# Altium schematic sheet RFID.SchDoc
size A3; SheetNumber: 1; SheetTotal: 1
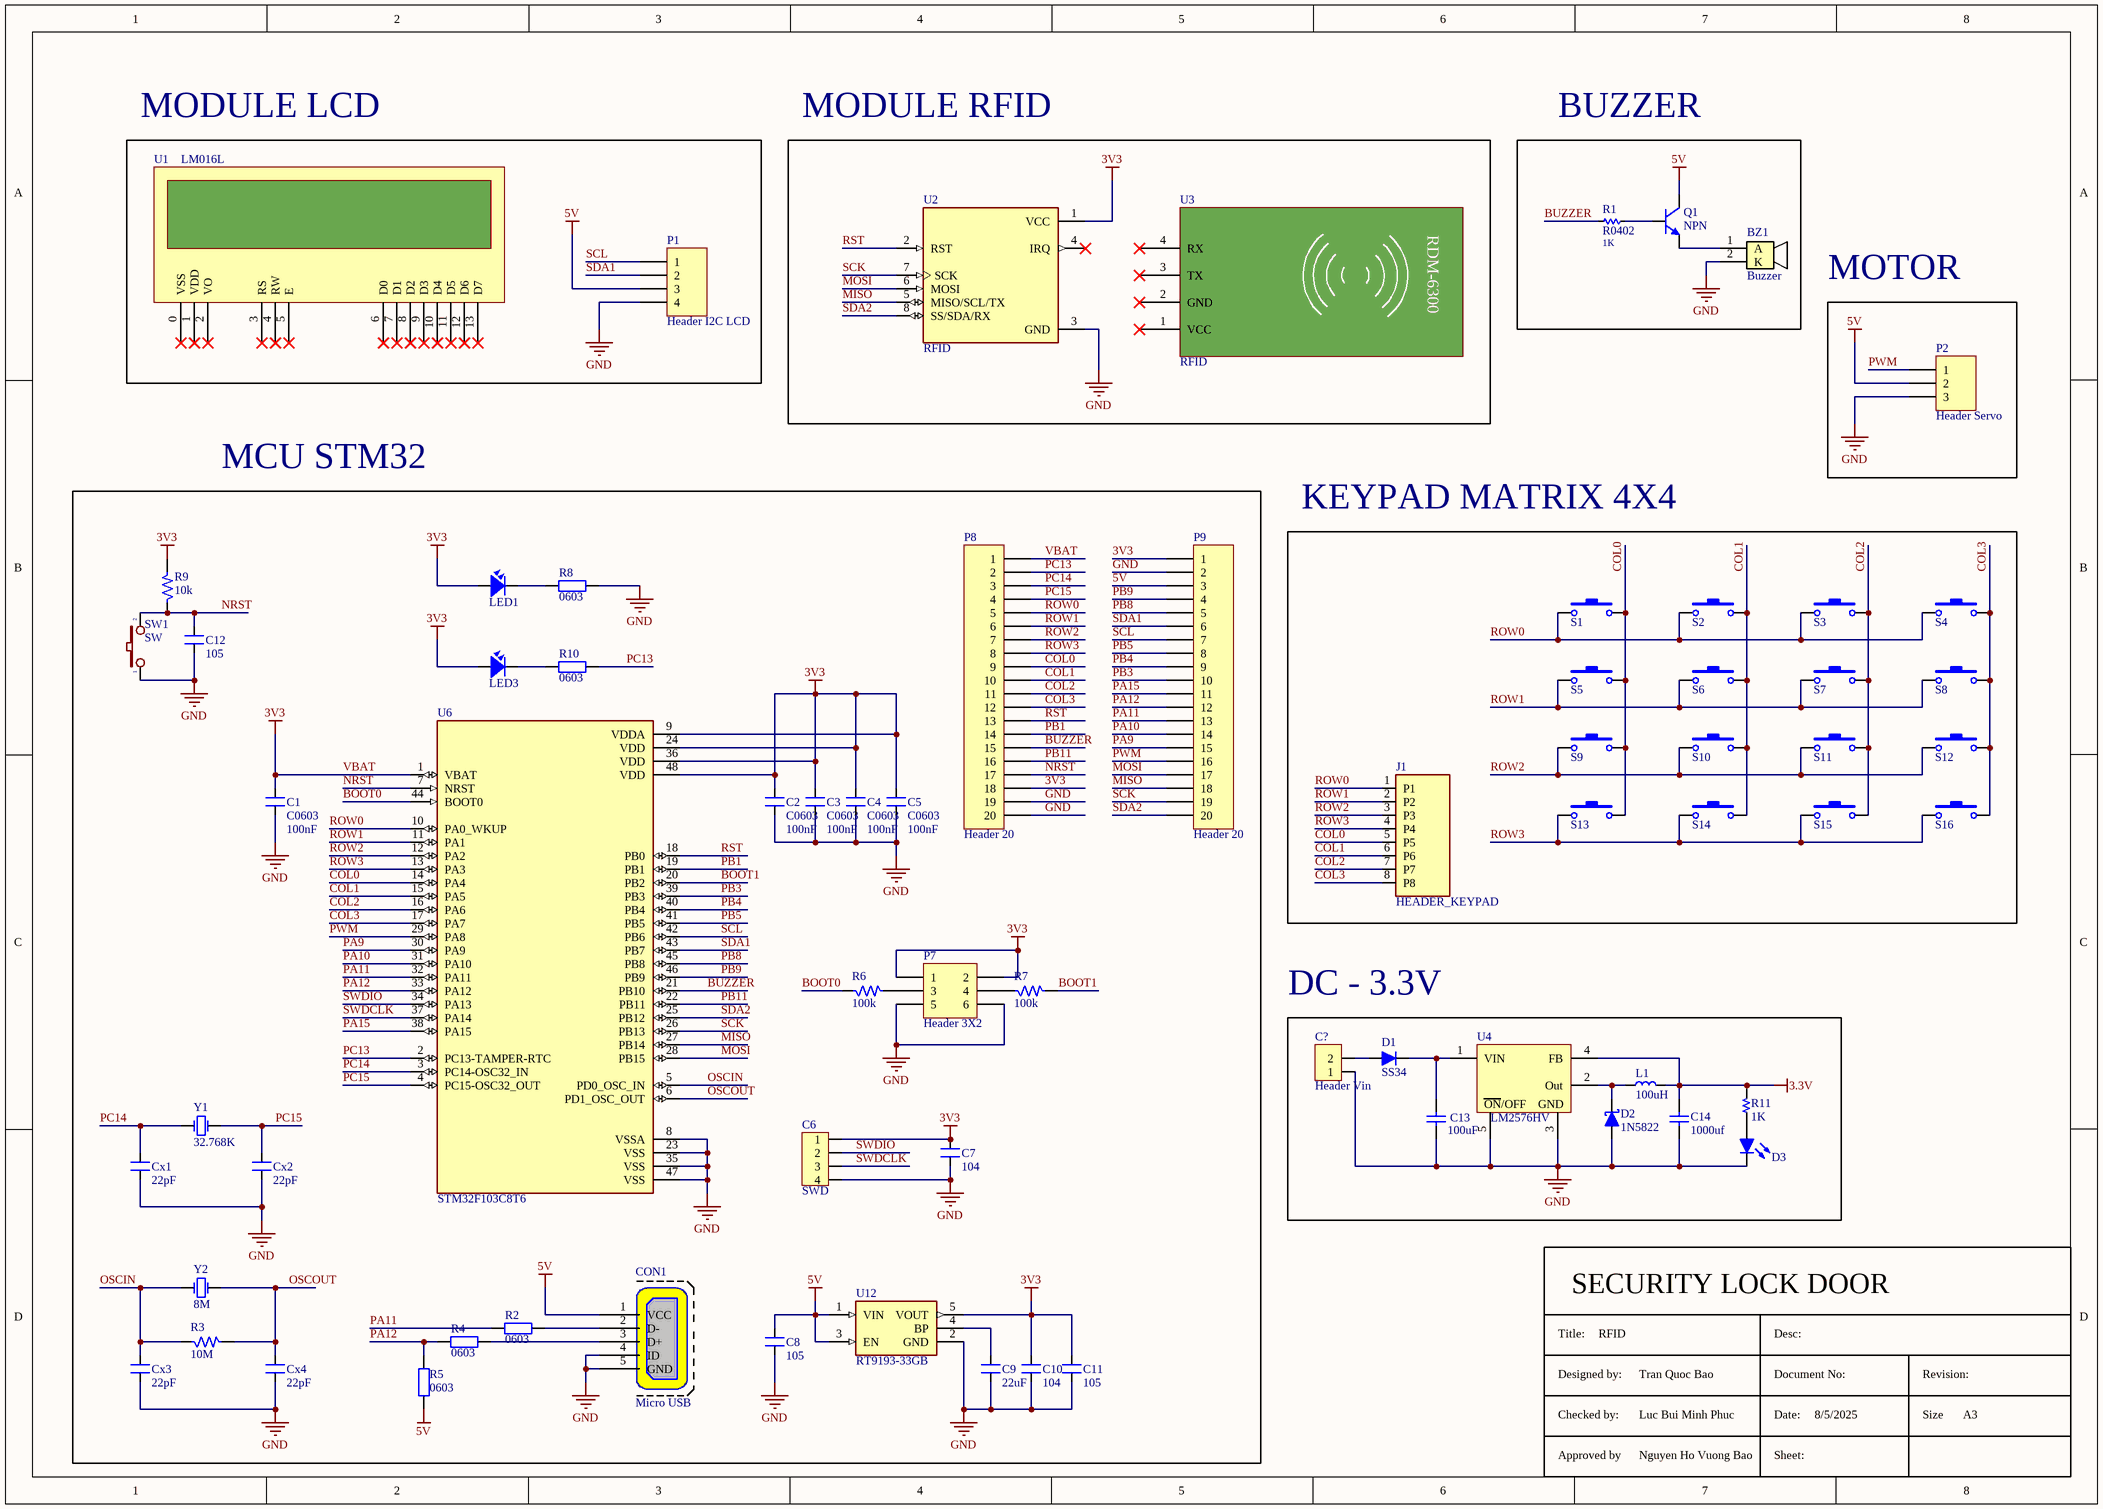
[diagram p0: RFID.SchDoc]

## Parts
BZ1  Buzzer  [BUZZER]
C1  C0603  value 100nF  [CN-SMD-0603]
C2  C0603  value 100nF  [CN-SMD-0603]
C3  C0603  value 100nF  [CN-SMD-0603]
C4  C0603  value 100nF  [CN-SMD-0603]
C5  C0603  value 100nF  [CN-SMD-0603]
C6  SWD  [HDR4]
C7  104  [CN2]
C8  105  [CN2]
C9  22uF  [CN2]
C10  104  [CN2]
C11  105  [CN2]
C12  105  [CN2]
C13  100uF  [C 0805]
C14  1000uf  [C 0805]
C?  Header Vin  [KF-128_2P]
CON1  Micro USB  [USB-B-Mini]
Cx1  22pF  [CN1]
Cx2  22pF  [CN1]
Cx3  22pF  [CN1]
Cx4  22pF  [CN1]
D1  SS34  [DO-35 (SOD27 )]
D2  1N5822  [DO-41]
D3  Led  [Led 0805 RED]  (value not drawn)
J1  HEADER_KEYPAD  [TE_826629-8]
L1  100uH  [Inductor SMD 12x12x8]
LED1  LED  [LED-3]  (value not drawn)
LED3  LED  [LED-3]  (value not drawn)
P1  Header I2C LCD  [HDR1X4]
P2  Header Servo  [HDR1X3]
P7  Header 3X2  [HDR2X3]
P8  Header 20  [HDR1X20]
P9  Header 20  [HDR1X20]
Q1  NPN  [TRAN-LOWPOWER]
R1  R0402  value 1K  [RES-SMD-0402]
R2  value 0603  [DIEN TRO 0805]  (hidden comment: R0603)
R3  10M  [SM-1206]
R4  value 0603  [DIEN TRO 0805]  (hidden comment: R0603)
R5  value 0603  [DIEN TRO 0805]  (hidden comment: R0603)
R6  100k  [SM-1206]
R7  100k  [SM-1206]
R8  value 0603  [DIEN TRO 0805]  (hidden comment: R0603)
R9  10k  [SM-1206]
R10  value 0603  [DIEN TRO 0805]  (hidden comment: R0603)
R11  1K  [R 0805]
S1  SW-SMD  [SW-SMD]  (value not drawn)
S2  SW-SMD  [SW-SMD]  (value not drawn)
S3  SW-SMD  [SW-SMD]  (value not drawn)
S4  SW-SMD  [SW-SMD]  (value not drawn)
S5  SW-SMD  [SW-SMD]  (value not drawn)
S6  SW-SMD  [SW-SMD]  (value not drawn)
S7  SW-SMD  [SW-SMD]  (value not drawn)
S8  SW-SMD  [SW-SMD]  (value not drawn)
S9  SW-SMD  [SW-SMD]  (value not drawn)
S10  SW-SMD  [SW-SMD]  (value not drawn)
S11  SW-SMD  [SW-SMD]  (value not drawn)
S12  SW-SMD  [SW-SMD]  (value not drawn)
S13  SW-SMD  [SW-SMD]  (value not drawn)
S14  SW-SMD  [SW-SMD]  (value not drawn)
S15  SW-SMD  [SW-SMD]  (value not drawn)
S16  SW-SMD  [SW-SMD]  (value not drawn)
SW1  SW  [SW2]
U1  LM016L
U2  RFID  [MODULE_CEG006900]
U3  RFID
U4  LM2576HV  [TO-263-5]
U6  STM32F103C8T6  [QFP50P900X900X160-48N]
U12  RT9193-33GB  [SOT94P279X129-5N]
Y1  32.768K  [xtal]
Y2  8M  [xtal]

## Blocks framed on the sheet
MODULE LCD: P1 U1
MODULE RFID: U2 U3
BUZZER: BZ1 Q1 R1
MOTOR: P2
MCU STM32: C1-C12 CON1 Cx1-Cx4 LED1 LED3 P7-P9 R2-R10 SW1 U6 U12 Y1 Y2
KEYPAD MATRIX 4X4: J1 S1-S16
DC - 3.3V: C13 C14 C? D1-D3 L1 R11 U4

## Nets
3.3V: C14.1 L1.2 R11.2 U4.4(FB)
3V3: C1.2 C2.2 C3.2 C4.2 C5.2 C6.1 C7.2 C10.2 C11.2 LED1.1 LED3.1 P7.1 P7.2 P8.1 P8.18 P9.1 R9.2 U2.1(VCC) U6.1(VBAT) U6.9(VDDA) U6.24(VDD) U6.36(VDD) U6.48(VDD) U12.5(VOUT)  [also labelled VBAT]
5V: C8.2 CON1.1(VCC) P1.3 P2.2 P9.3 Q1.2(C) R5.1 U12.1(VIN) U12.3(EN)
GND: BZ1.2(K) C1.1 C2.1 C3.1 C4.1 C5.1 C6.4 C7.1 C8.1 C9.1 C10.1 C11.1 C12.1 C13.2 C14.2 C?.1 CON1.4(ID) CON1.5(GND) CON1.6(GND) CON1.7(GND) CON1.8(GND) CON1.9(GND) Cx1.1 Cx2.1 Cx3.1 Cx4.1 D2.1(A) D3.2(K) P1.4 P2.3 P7.5 P7.6 P8.19 P8.20 P9.2 R8.2 SW1.1 U2.3(GND) U4.3(GND) U4.5(~{ON}/OFF) U6.8(VSSA) U6.23(VSS) U6.35(VSS) U6.47(VSS) U12.2(GND)
BOOT0: R6.1 U6.44(BOOT0)
BOOT1: R7.2 U6.20(PB2)
BUZZER: P8.15 R1.2 U6.21(PB10)
COL0: J1.5(P5) P8.9 S1.2 S5.2 S9.2 S13.2 U6.14(PA4)
COL1: J1.6(P6) P8.10 S2.2 S6.2 S10.2 S14.2 U6.15(PA5)
COL2: J1.7(P7) P8.11 S3.2 S7.2 S11.2 S15.2 U6.16(PA6)
COL3: J1.8(P8) P8.12 S4.2 S8.2 S12.2 S16.2 U6.17(PA7)
MISO: P9.18 U2.5(MISO/SCL/TX) U6.27(PB14)
MOSI: P9.17 U2.6(MOSI) U6.28(PB15)
NRST: C12.2 P8.17 R9.1 SW1.2 U6.7(NRST)
OSCIN: Cx3.2 R3.1 U6.5(PD0_OSC_IN) Y2.1(OSC1)
OSCOUT: Cx4.2 R3.2 U6.6(PD1_OSC_OUT) Y2.2(OSC2)
PA9: P9.15 U6.30(PA9)
PA10: P9.14 U6.31(PA10)
PA11: P9.13 R2.1 U6.32(PA11)
PA12: P9.12 R4.1 R5.2 U6.33(PA12)
PA15: P9.11 U6.38(PA15)
PB1: P8.14 U6.19(PB1)
PB3: P9.10 U6.39(PB3)
PB4: P9.9 U6.40(PB4)
PB5: P9.8 U6.41(PB5)
PB8: P9.5 U6.45(PB8)
PB9: P9.4 U6.46(PB9)
PB11: P8.16 U6.22(PB11)
PC13: P8.2 R10.2 U6.2(PC13-TAMPER-RTC)
PC14: Cx1.2 P8.3 U6.3(PC14-OSC32_IN) Y1.1(OSC1)
PC15: Cx2.2 P8.4 U6.4(PC15-OSC32_OUT) Y1.2(OSC2)
PWM: P2.1 P9.16 U6.29(PA8)
ROW0: J1.1(P1) P8.5 S1.1 S2.1 S3.1 S4.1 U6.10(PA0_WKUP)
ROW1: J1.2(P2) P8.6 S5.1 S6.1 S7.1 S8.1 U6.11(PA1)
ROW2: J1.3(P3) P8.7 S9.1 S10.1 S11.1 S12.1 U6.12(PA2)
ROW3: J1.4(P4) P8.8 S13.1 S14.1 S15.1 S16.1 U6.13(PA3)
RST: P8.13 U2.2(RST) U6.18(PB0)
SCK: P9.19 U2.7(SCK) U6.26(PB13)
SCL: P1.1 P9.7 U6.42(PB6)
SDA1: P1.2 P9.6 U6.43(PB7)
SDA2: P9.20 U2.8(SS/SDA/RX) U6.25(PB12)
SWDCLK: C6.3 U6.37(PA14)
SWDIO: C6.2 U6.34(PA13)
NetBZ1_1: BZ1.1(A) Q1.1(E)
NetC9_2: C9.2 U12.4(BP)
NetC13_1: C13.1 D1.2(K) U4.1(VIN)
NetC?_2: C?.2 D1.1(A)
NetCON1_2: CON1.2(D-) R2.2
NetCON1_3: CON1.3(D+) R4.2
NetD2_2: D2.2(K) L1.1 U4.2(Out)
NetD3_1: D3.1(A) R11.1
NetLED1_2: LED1.2 R8.1
NetLED3_2: LED3.2 R10.1
NetP7_3: P7.3 R6.2
NetP7_4: P7.4 R7.1
NetQ1_3: Q1.3(B) R1.1

Not connected (* = marked no-connect by the designer): U1 0(VSS)* 1(VDD)* 2(VO)* 3(RS)* 4(RW)* 5(E)* 6(D0)* 7(D1)* 8(D2)* 9(D3)* 10(D4)* 11(D5)* 12(D6)* 13(D7)*; U2 4(IRQ)*; U3 1(VCC)* 2(GND)* 3(TX)* 4(RX)*; U4 6(PAD)

## Notes on the sheet
- SECURITY LOCK DOOR
- Title:
- Designed by:
- RFID
- Tran Quoc Bao
- Desc:
- Document No:
- Revision:
- Checked by:
- Approved by
- Luc Bui Minh Phuc
- Nguyen Ho Vuong Bao
- Date:
- Sheet:
- 8/5/2025
- Size
- A3
- (in symbol LM2596S-5.0) ON/OFF
- (in symbol RFID) RDM-6300

## Library data of the parts
C1-C5 = CAP-SMD-0603: Cap SMD
C6 = Header4: Header IDC, 4 x 1 Pin Vertical 2.54mm Pitch (Non-Boxed, Male); Manufacturer: W¨¹rth Elektronik eiSos GmbH; partNo: 613002143121; ComponentLink1 Description: Manufacturer; ComponentLink2 Description: Datasheet; NoPins: 02; Created Date: 29 March 2013; ComponentLink1URL: http://www.we-online.com; ComponentLink2URL: http://katalog.we-online.de/em/datasheet/6130xx143121.pdf; Created by: Karrer Zheng
C7-C12 = CN2: Cap np 104 => 105pF; Value: 0.1uF
C13 C14 = Capacitor NP: Capacitor non-pol
C? = Header2: Header IDC, 2 x 1 Pin Vertical 2.54mm Pitch (Non-Boxed, Male); Manufacturer: W¨¹rth Elektronik eiSos GmbH; partNo: 613002143121; ComponentLink1 Description: Manufacturer; ComponentLink2 Description: Datasheet; NoPins: 02; Created Date: 29 March 2013; ComponentLink1URL: http://www.we-online.com; ComponentLink2URL: http://katalog.we-online.de/em/datasheet/6130xx143121.pdf; Created by: Karrer Zheng
CON1 = USB Mini B: Value: USB Mini B
Cx1-Cx4 = CAP-DIP: Cremic For Xtal 1pF => 100pF; Value: 33pF
D1 = Diode: Default Diode
D2 = Diode Schottky: Schottky Diode
D3 = Led: Typical LED
J1 = 826629-8: Conn Unshrouded Header HDR 8 POS 2.54mm Solder ST Thru-Hole Automotive Box; MF: TE Connectivity; Value: *; SnapEDA_Link: https://www.snapeda.com/parts/826629-8/TE+Connectivity+AMP+Connectors/view-part/?ref=snap; Purchase-URL: https://pricing.snapeda.com/search/part/826629-8/?ref=eda; EU_RoHS_Compliance: Compliant; Availability: In Stock; Price: None; Package: None; Check_prices: https://www.snapeda.com/parts/826629-8/TE+Connectivity+AMP+Connectors/view-part/?ref=eda; MP: 826629-8
L1 = Inductor
LED1 LED3 = LED: LED Single colour Green and Red; Value: LED 3 ly Single Colour
P1 = Header 4: Header, 4-Pin; LatestRevisionDate: 17-Jul-2002; LatestRevisionNote: Re-released for DXP Platform.; Publisher: Altium Limited
P2 = Header 3: Header, 3-Pin; LatestRevisionDate: 17-Jul-2002; LatestRevisionNote: Re-released for DXP Platform.; Publisher: Altium Limited
P7 = Header 3X2: Header, 3-Pin, Dual row; LatestRevisionDate: 17-Jul-2002; LatestRevisionNote: Re-released for DXP Platform.; Publisher: Altium Limited
P8 P9 = Header 20: Header, 20-Pin; LatestRevisionDate: 17-Jul-2002; LatestRevisionNote: Re-released for DXP Platform.; Publisher: Altium Limited
Q1 = NPN: NPN General; Published: 8-Jun-2000; LatestRevisionDate: 15-Jan-2003; LatestRevisionNote: PCB Footprint 'BCY-W3/D4.7' replaced; DatasheetDocument: 1997; PackageDocument: Sep-1998; PackageReference: TO-92A; Publisher: Altium Limited; Code_JEDEC: TO-92A; ComponentLink1Description: Manufacturer Link; ComponentLink1URL: http://www.fairchildsemi.com/; ComponentLink2Description: Datasheet; ComponentLink2URL: http://www.fairchildsemi.com/ds/2N%2F2N3904.pdf
R1 = Res-SMD-0402: Resistor; Manufacturer: Generic Components; Class: Passive; Published: 08/06/2000; Publisher: Altium Hobart Technology Centre
R2 R4 R5 R8 R10 = R0603: Resistor SMD 0603; Published: 8-Jun-2000; LatestRevisionDate: 17-Jul-2002; LatestRevisionNote: Re-released for DXP Platform.; PackageReference: AXIAL-0.4; Publisher: Altium Limited
R3 R6 R7 R9 = R: Resistor 1/4W; Value: R1/4W - 1K
R11 = Resistor
S1-S16 = SW-SMD: Switch; Published: 24-Mar-1999; LatestRevisionDate: 17-Jul-2002; LatestRevisionNote: Re-released for DXP Platform.; PackageReference: SPST-2; Publisher: Altium Limited
SW1 = SW2: Switch button 2 pin; Value: SW chip 2 pin
U2 = CEG006900: RFID RC522 Reader IC Card Module Tags SPI Interface Read and Write; MF: YKS; Value: *; SnapEDA_Link: https://www.snapeda.com/parts/CEG006900/YKS/view-part/?ref=snap; MP: CEG006900; Check_prices: https://www.snapeda.com/parts/CEG006900/YKS/view-part/?ref=eda; Availability: Not in stock; Price: None; Package: None
U4 = LM2596S-5.0: Simple Switcher 3A Step-Down Voltage Regulator
U6 = STM32F103C8T6: ARM® Cortex®-M3 STM32F1 Microcontroller IC 32-Bit 72MHz 64KB (64K x 8) FLASH 48-LQFP (7x7); MF: STMicroelectronics; SnapEDA_Link: https://www.snapeda.com/parts/STM32F103C8T6/STMicroelectronics/view-part/?ref=snap; Package: LQFP-48 STMicroelectronics; Value: *; MP: STM32F103C8T6; Check_prices: https://www.snapeda.com/parts/STM32F103C8T6/STMicroelectronics/view-part/?ref=eda
U12 = RT9193-33GB: Linear Voltage Regulator IC Positive Fixed 1 Output 300mA TSOT-23-5; MF: Richtek USA; SnapEDA_Link: https://www.snapeda.com/parts/RT9193-33GB/Richtek+USA+Inc./view-part/?ref=snap; Package: SOT-23-5 Richtek; MP: RT9193-33GB; Check_prices: https://www.snapeda.com/parts/RT9193-33GB/Richtek+USA+Inc./view-part/?ref=eda; Purchase-URL: https://pricing.snapeda.com/search/part/RT9193-33GB/?ref=eda; Digi-Key_Part_Number: 1028-1014-2-ND; Value: *
Y1 Y2 = Crystal 2p: Crystal Oscillator; Published: 8-Jun-2000; LatestRevisionDate: 17-Jul-2002; LatestRevisionNote: Re-released for DXP Platform.; PackageReference: R38; Publisher: Altium Limited